# Altium schematic sheet rs232_24V_step_Vano.SchDoc: Название платы
size 594 x 420 mm; ApprovedBy: Рогов; CheckedBy: Фамилия проверяющего; DrawnBy: Фамилия разработчика; DocumentNumber: Введите номер платы + Э3; SheetNumber: пусто если листов 1, иначе 1; SheetTotal: количество листов; Format: A2; DocumentType: тип схемы; Title1str: (вторая строка при необходимости); ImagePath: Введите номер платы
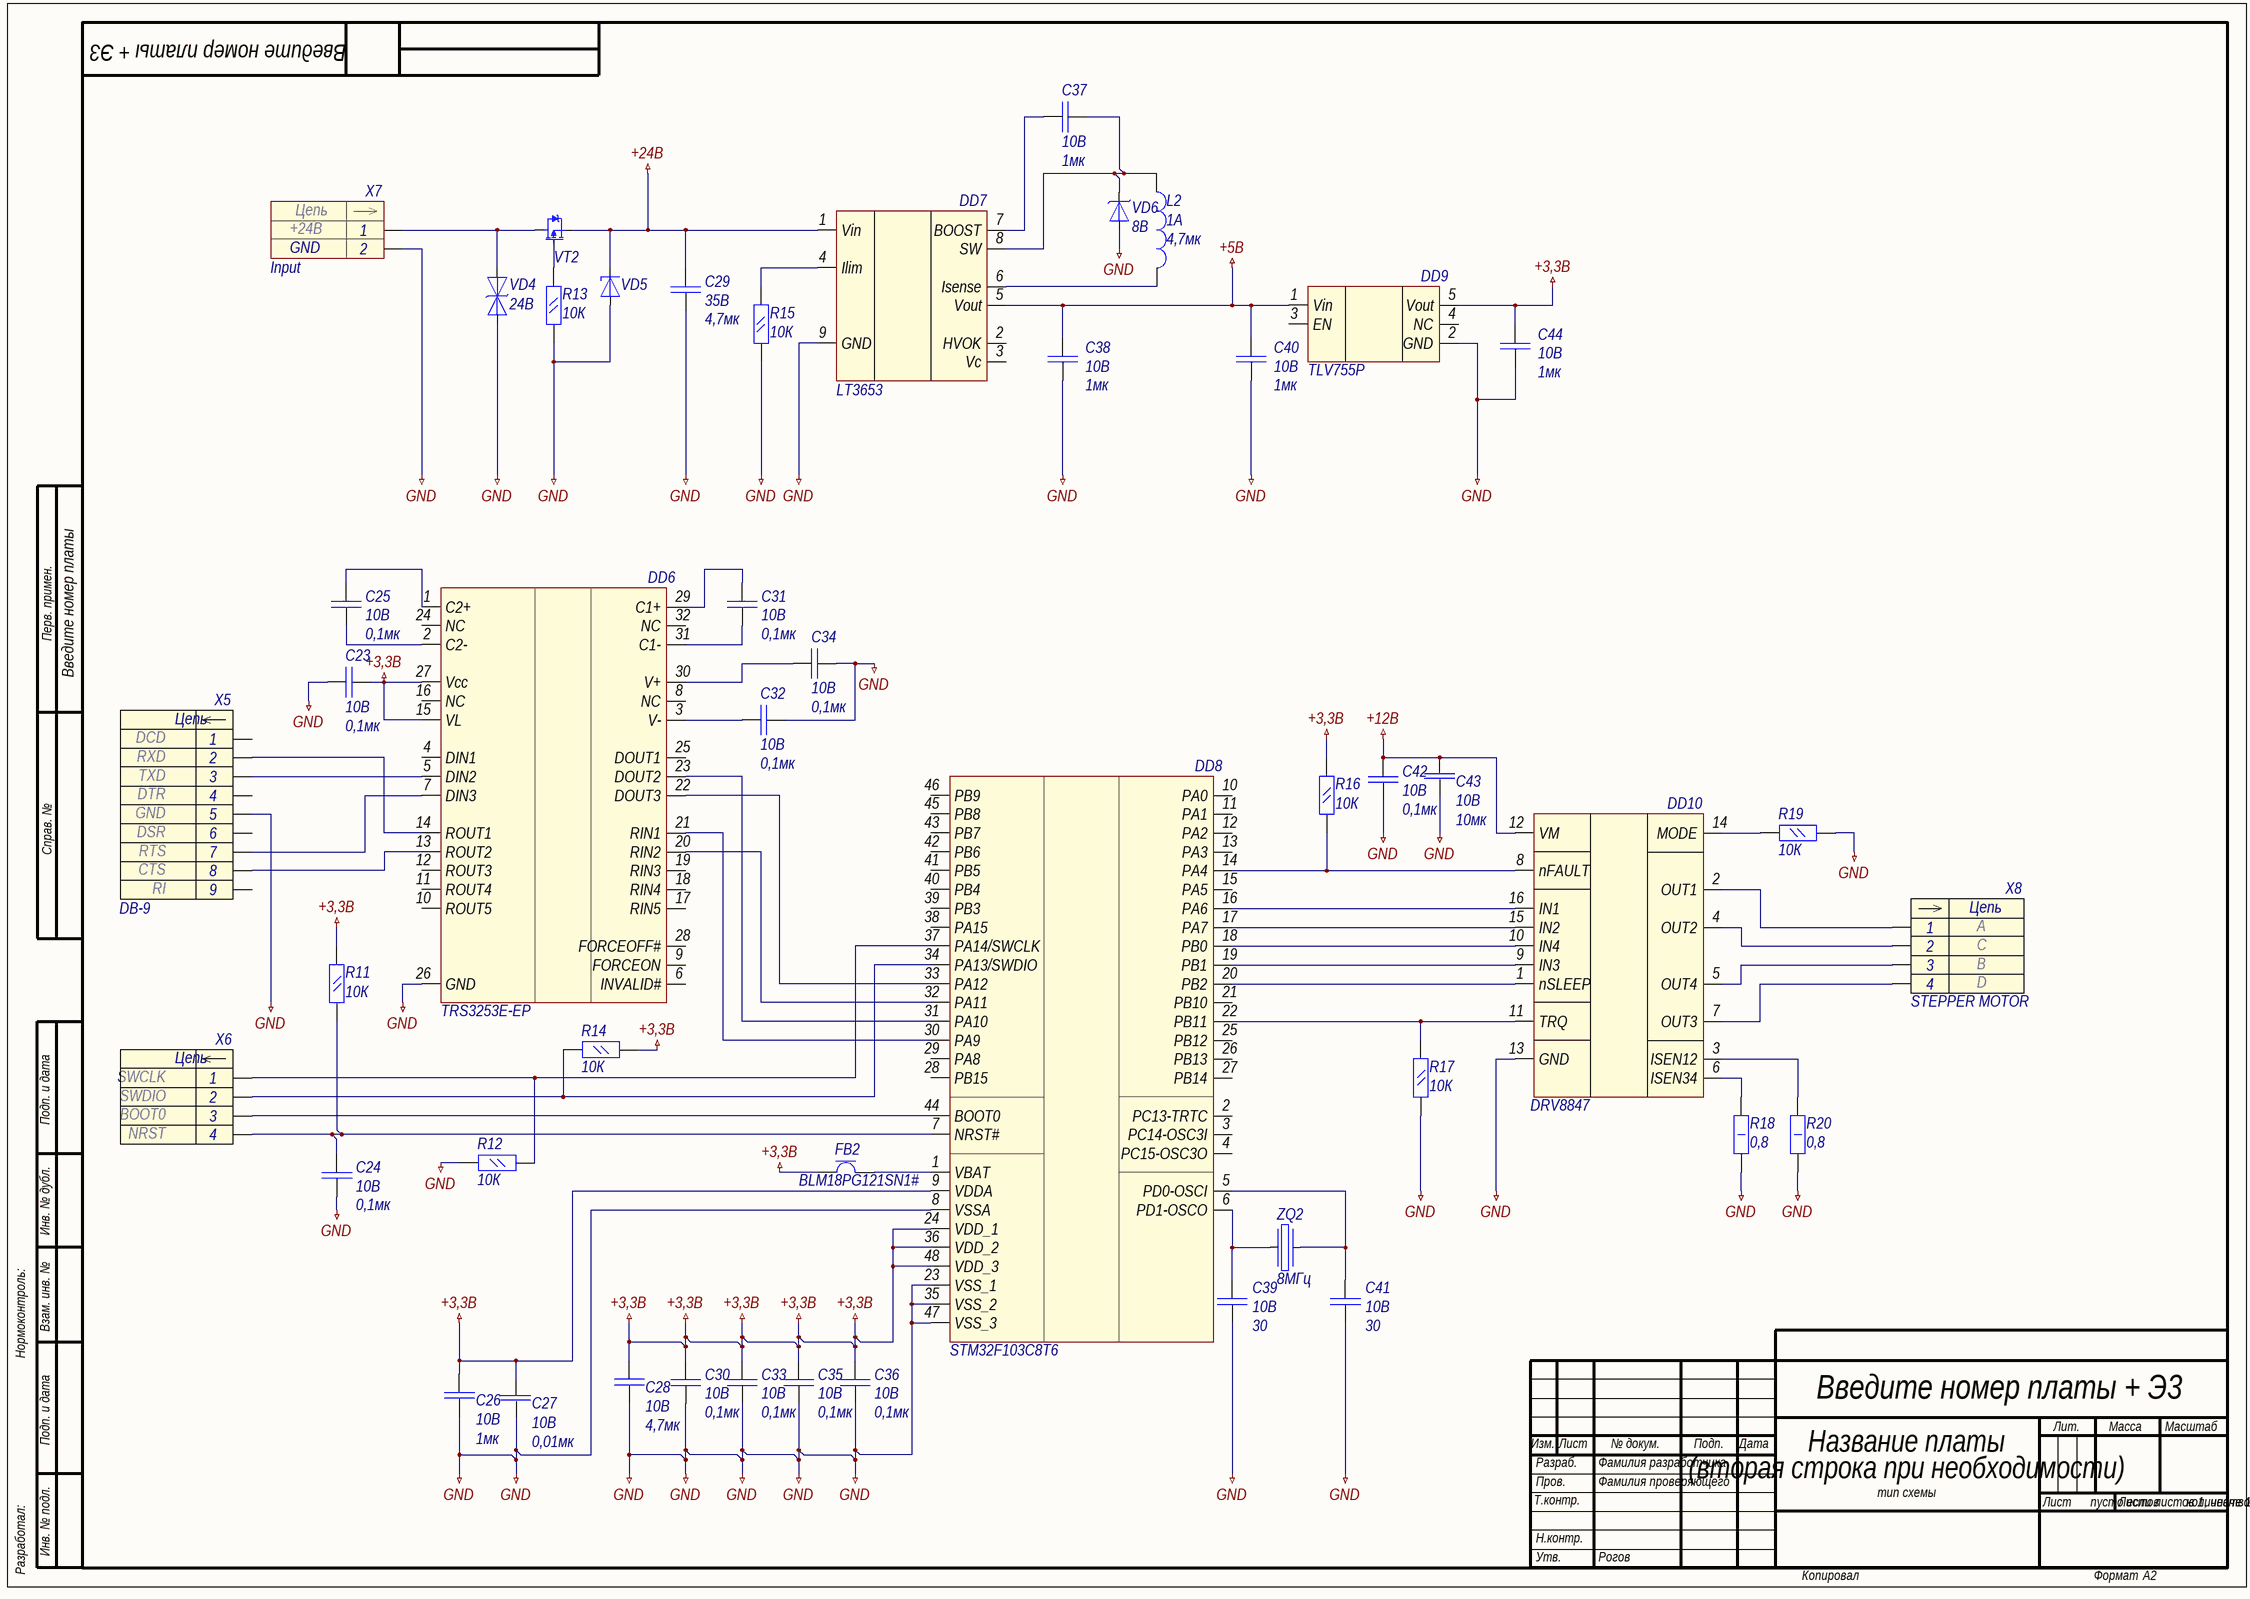
[diagram p0: rs232_24V_step_Vano.SchDoc]

## Parts
C23  Voltage: 10В  Capacitance: 0,1мк  [CH0402C]  (hidden comment: Capacitor)
C24  Voltage: 10В  Capacitance: 0,1мк  [CH0402C]  (hidden comment: Capacitor)
C25  Voltage: 10В  Capacitance: 0,1мк  [CH0402C]  (hidden comment: Capacitor)
C26  Voltage: 10В  Capacitance: 1мк  [CH0201C]  (hidden comment: Capacitor)
C27  Voltage: 10В  Capacitance: 0,01мк  [CH0402C]  (hidden comment: Capacitor)
C28  Voltage: 10В  Capacitance: 4,7мк  [CH0402C]  (hidden comment: Capacitor)
C29  Voltage: 35В  Capacitance: 4,7мк  [CH0603C]  (hidden comment: Capacitor)
C30  Voltage: 10В  Capacitance: 0,1мк  [CH0402C]  (hidden comment: Capacitor)
C31  Voltage: 10В  Capacitance: 0,1мк  [CH0402C]  (hidden comment: Capacitor)
C32  Voltage: 10В  Capacitance: 0,1мк  [CH0402C]  (hidden comment: Capacitor)
C33  Voltage: 10В  Capacitance: 0,1мк  [CH0402C]  (hidden comment: Capacitor)
C34  Voltage: 10В  Capacitance: 0,1мк  [CH0402C]  (hidden comment: Capacitor)
C35  Voltage: 10В  Capacitance: 0,1мк  [CH0402C]  (hidden comment: Capacitor)
C36  Voltage: 10В  Capacitance: 0,1мк  [CH0402C]  (hidden comment: Capacitor)
C37  Voltage: 10В  Capacitance: 1мк  [CH0201C]  (hidden comment: Capacitor)
C38  Voltage: 10В  Capacitance: 1мк  [CH0201C]  (hidden comment: Capacitor)
C39  Voltage: 10В  Capacitance: 30  [CH0201C]  (hidden comment: Capacitor)
C40  Voltage: 10В  Capacitance: 1мк  [CH0201C]  (hidden comment: Capacitor)
C41  Voltage: 10В  Capacitance: 30  [CH0201C]  (hidden comment: Capacitor)
C42  Voltage: 10В  Capacitance: 0,1мк  [CH0402C]  (hidden comment: Capacitor)
C43  Voltage: 10В  Capacitance: 10мк  [CH0402C]  (hidden comment: Capacitor)
C44  Voltage: 10В  Capacitance: 1мк  [CH0201C]  (hidden comment: Capacitor)
DD6  TRS3253E-EP  [TRS3253E-EP]
DD7  LT3653  [LT3653]
DD8  STM32F103C8T6  [STM32F103 48pins]
DD9  TLV755P  [SOT23-5]
DD10  DRV8847  [DRV8847]
FB2  Model: BLM18PG121SN1#  [CH0603L]  (hidden comment: Ferrite bead)
L2  Max current: 1А  Inductance: 4,7мк  [CH0805L]  (hidden comment: Inductor)
R11  Impedance: 10К  [CH0805R]  (hidden comment: Res_0.125)
R12  Impedance: 10К  [CH0805R]  (hidden comment: Res_0.125)
R13  Impedance: 10К  [CH0402R]  (hidden comment: Res_0.125)
R14  Impedance: 10К  [CH0805R]  (hidden comment: Res_0.125)
R15  Impedance: 10К  [CH0402R]  (hidden comment: Res_0.125)
R16  Impedance: 10К  [CH0402R]  (hidden comment: Res_0.125)
R17  Impedance: 10К  [CH0402R]  (hidden comment: Res_0.125)
R18  Impedance: 0,8  [CH2010R]  (hidden comment: Res_1)
R19  Impedance: 10К  [CH0402R]  (hidden comment: Res_0.125)
R20  Impedance: 0,8  [CH2010R]  (hidden comment: Res_1)
VD4  Thresh_Voltage: 24В  [SOD323]  (hidden comment: TVS-diod_simmetrical)
VD5  Diod Zener  [SOD123]  (value not drawn)
VD6  Clamping_Voltage: 8В  [SOD123W]  (hidden comment: TVS-diod_directed)
VT2  P-Channel  [SOT23_132]  (value not drawn)
X5  DB-9  1: DCD  2: RXD  3: TXD  4: DTR  5: GND  6: DSR  7: RTS  8: CTS  9: RI  [CON: DB-9F]
X6  2: SWDIO  3: BOOT0  1: SWCLK  4: NRST  [CON: CWF-4R]  (hidden comment: 4_pins)
X7  Input  Vcc: +24В  [CON: 163-179PH-EX]
X8  STEPPER MOTOR  2: C  3: B  1: A  4: D  [CON: CWF-4R]
ZQ2  Freq: 8МГц  [OSC: 5032]  (hidden comment: Oscillator)

## Nets
+3,3В: C23.2(C1-) C26.2(C1-) C27.1(С+) C28.2(C1-) C30.1(C1+) C33.1(C1+) C35.1(C1+) C36.1(C1+) C44.1(C1+) DD6.15(VL) DD6.27(Vcc) DD8.9(VDDA) DD8.24(VDD_1) DD8.36(VDD_2) DD8.48(VDD_3) DD9.5(Vout) FB2.1 R11.1(C1-) R14.2(C1-) R16.1(C1-)
+5В: C38.1(C1+) C40.1(C1+) DD7.5(Vout) DD9.1(Vin)
+12В: C42.1(C1+) C43.1(С+) DD10.12(VM)
+24В: C29.1(C1+) DD7.1(Vin) VD5.2(C) VT2.3(S)
GND: C23.1(C1+) C24.2(C1-) C26.1(C1+) C27.2(С-) C28.1(C1+) C29.2(C1-) C30.2(C1-) C32.2(C1-) C33.2(C1-) C34.2(C1-) C35.2(C1-) C36.2(C1-) C38.2(C1-) C39.2(C1-) C40.2(C1-) C41.2(C1-) C42.2(C1-) C43.2(С-) C44.2(C1-) DD6.26(GND) DD7.9(GND) DD8.8(VSSA) DD8.23(VSS_1) DD8.35(VSS_2) DD8.47(VSS_3) DD9.2(GND) DD10.13(GND) R12.1(C1-) R13.1 R15.1 R17.2(C1-) R18.1 R19.1(C1-) R20.1 VD4.1(A) VD5.1(A) VD6.1(A) X5.5 X7.2
NetC24_1: C24.1(C1+) DD8.7(NRST#) R11.2(C1-) X6.4
NetC25_1: C25.1(C1+) DD6.1(C2+)
NetC25_2: C25.2(C1-) DD6.2(C2-)
NetC31_1: C31.1(C1+) DD6.29(C1+)
NetC31_2: C31.2(C1-) DD6.31(C1-)
NetC32_1: C32.1(C1+) DD6.3(V-)
NetC34_1: C34.1(C1+) DD6.30(V+)
NetC37_1: C37.1(C1+) DD7.7(BOOST)
NetC37_2: C37.2(C1-) DD7.8(SW) L2.1 VD6.2(C)
NetC39_1: C39.1(C1+) DD8.6(PD1-OSCO) ZQ2.1
NetC41_1: C41.1(C1+) DD8.5(PD0-OSCI) ZQ2.3
NetDD6_5: DD6.5(DIN2) X5.3
NetDD6_7: DD6.7(DIN3) X5.7
NetDD6_13: DD6.13(ROUT2) X5.8
NetDD6_14: DD6.14(ROUT1) X5.2
NetDD6_20: DD6.20(RIN2) DD8.32(PA11)
NetDD6_21: DD6.21(RIN1) DD8.30(PA9)
NetDD6_22: DD6.22(DOUT3) DD8.33(PA12)
NetDD6_23: DD6.23(DOUT2) DD8.31(PA10)
NetDD7_4: DD7.4(Ilim) R15.2
NetDD7_6: DD7.6(Isense) L2.2
NetDD8_1: DD8.1(VBAT) FB2.2
NetDD8_14: DD8.14(PA4) DD10.8(nFAULT) R16.2(C1-)
NetDD8_16: DD8.16(PA6) DD10.16(IN1)
NetDD8_17: DD8.17(PA7) DD10.15(IN2)
NetDD8_18: DD8.18(PB0) DD10.10(IN4)
NetDD8_19: DD8.19(PB1) DD10.9(IN3)
NetDD8_20: DD8.20(PB2) DD10.1(nSLEEP)
NetDD8_22: DD8.22(PB11) DD10.11(TRQ) R17.1(C1-)
NetDD8_34: DD8.34(PA13/SWDIO) R14.1(C1-) X6.2
NetDD8_37: DD8.37(PA14/SWCLK) R12.2(C1-) X6.1
NetDD8_44: DD8.44(BOOT0) X6.3
NetDD10_2: DD10.2(OUT1) X8.1
NetDD10_3: DD10.3(ISEN12) R20.2
NetDD10_4: DD10.4(OUT2) X8.2
NetDD10_5: DD10.5(OUT4) X8.3
NetDD10_6: DD10.6(ISEN34) R18.2
NetDD10_7: DD10.7(OUT3) X8.4
NetDD10_14: DD10.14(MODE) R19.2(C1-)
NetR13_2: R13.2 VT2.1(G)
NetVD4_2: VD4.2(C) VT2.2(D) X7.1

Not connected (* = marked no-connect by the designer): DD6 4(DIN1) 6(INVALID#) 8(NC) 9(FORCEON) 10(ROUT5) 11(ROUT4) 12(ROUT3) 16(NC) 17(RIN5) 18(RIN4) 19(RIN3) 24(NC) 25(DOUT1) 28(FORCEOFF#) 32(NC); DD7 2(HVOK) 3(Vc); DD8 2(PC13-TRTC) 3(PC14-OSC3I) 4(PC15-OSC3O) 10(PA0) 11(PA1) 12(PA2) 13(PA3) 15(PA5) 21(PB10) 25(PB12) 26(PB13) 27(PB14) 28(PB15) 29(PA8) 38(PA15) 39(PB3) 40(PB4) 41(PB5) 42(PB6) 43(PB7) 45(PB8) 46(PB9); DD9 3(EN) 4(NC); X5 1 4 6 9

## Notes on the sheet
- Перв. примен.
- Справ. №
- Подп. и дата
- Инв. № дубл.
- Нормоконтроль:
- Взам. инв. №
- Изм.
- Лист
- № докум.
- Подп.
- Дата
- Лит.
- Масса
- Масштаб
- Т.контр.
- Пров.
- Разраб.
- Листов
- Разработал:
- Инв. № подл.
- Н.контр.
- Утв.
- Копировал
- Формат
- (in symbol 2_pins) Цепь; GND
- (in symbol 4_pins) Цепь
- (in symbol 9_pins) Цепь

## Library data of the parts
C23-C25 C30-C36 C42 = Capacitor: Manufacture: AVX; Model: 0402ZD103KAT2A; Case: 0402; HelpURL: https://ru.mouser.com/ProductDetail/AVX/0402ZD103KAT2A?qs=sGAEpiMZZMs0AnBnWHyRQKdiqyDPVQdAu74W%2fwwRq8A%3d
C26 C37 C38 C40 C44 = Capacitor: Manufacture: Murata Electronics; Model: GRM033C81A105ME05E; Case: 0201; HelpURL: https://ru.mouser.com/ProductDetail/Murata-Electronics/GRM033C81A105ME05E?qs=sGAEpiMZZMs0AnBnWHyRQN7%2fAA2D2lPPXfhIkJ3ChWM%252bNp28BKy3Ug%3d%3d
C27 = Capacitor: Manufacture: Yageo; Model: CC0402MRX7R6BB103; Case: 0402; HelpURL: https://ru.mouser.com/ProductDetail/Yageo/CC0402MRX7R6BB103?qs=sGAEpiMZZMs0AnBnWHyRQCF1lTWZ1EBLC11KxQK9NtY%3D
C28 = Capacitor: Manufacture: Murata Electronics; Model: ZRB15XR61A475KE01D; Case: 0402; HelpURL: https://ru.mouser.com/ProductDetail/Murata-Electronics/ZRB15XR61A475KE01D?qs=sGAEpiMZZMs0AnBnWHyRQO9VYadaKTO%252beZnE9zFUsbv4FmCibz4ZfQ%3d%3d
C29 = Capacitor: Manufacture: TDK; Model: C1608JB1V475M080AC; Case: 0603; HelpURL: https://ru.mouser.com/ProductDetail/TDK/C1608JB1V475M080AC?qs=sGAEpiMZZMs0AnBnWHyRQFv7x1xn%252bYFd6VAPnwlpyGEmZrVGUJGxTQ%3d%3d
C39 C41 = Capacitor: Manufacture: KEMET; Model: CBR02C308B8GAC; Case: 0201; HelpURL: https://ru.mouser.com/ProductDetail/KEMET/CBR02C308B8GAC?qs=sGAEpiMZZMs0AnBnWHyRQKJCfzG%2fi9wHnix1yOwfSPhOUzhoHh%252bTpQ%3d%3d
C43 = Capacitor: Manufacture: Yageo; Model: CC0402MRX5R6BB106; Case: 0402; HelpURL: https://ru.mouser.com/ProductDetail/Yageo/CC0402MRX5R6BB106?qs=sGAEpiMZZMsh%252B1woXyUXj67dvM3QAimZTx2LImfM178%3D
DD6 = TRS3253E-EP: UART - RS232; Manufacture: Texas Instruments; Model: TRS3253E-EP; Case: PQFN-32; HelpURL: http://www.ti.com/product/trs3253e-ep
DD7 = LT3653: 7.5~30 to 5; Case: *; Manufacture: *; Model: LT3653; HelpURL: *
DD8 = STM32: Manufacture: STMicroelectronics; Case: LQFP48; Model: STM32F103C8T6; HelpURL: https://www.st.com/en/microcontrollers-microprocessors/stm32f103c8.html
DD9 = LDO +3.3V: Manufacture: Texas Instruments; Case: SOT-23; HelpUrL: http://www.ti.com/product/TLV755P?keyMatch=TLV755P&tisearch=Search-EN-Everything; Model: TLV755P
DD10 = DRV8847: Manufacture: Texas Instruments; HelpURL: http://www.ti.com/product/DRV8847; Case: TSSOP; Model: DRV8847
FB2 = Ferrite bead: Manufacture: murata; Max current: 2A; Impedance: 120; Case: 0603; HelpURL: https://www.murata.com/en-us/products/productdetail?partno=BLM18PG121SN1%23; Inductance: *
L2 = Inductor: Manufacture: Panasonic; Model: ELG-TEA4R7NA; Impedance: 300м; HelpURL: https://ru.mouser.com/ProductDetail/Panasonic/ELG-TEA4R7NA?qs=sGAEpiMZZMsg%252by3WlYCkU%252bdHxGw%252bjF29VUqcX1cNOgM%3d; Case: 0805
R11 R12 R14 = Res_0.125: Manufacture: Panasonic Industrial Devices; Model: ERJ-6ENF9091V; Case: 0805; HelpURL: https://ru.mouser.com/ProductDetail/Panasonic-Industrial-Devices/ERJ-6ENF9091V?qs=sGAEpiMZZMvdGkrng054tx7%2f6%252bNA3LAJZkxjwUnWjWM%3d
R13 R15-R17 R19 = Res_0.125: Manufacture: Yageo; Model: AC0402FR-7W10KL; Case: 0402; HelpURL: https://ru.mouser.com/ProductDetail/Yageo/AC0402FR-7W10KL?qs=sGAEpiMZZMvdGkrng054txbN%2f5LBcxld3gyqgmBuiXRPLjwmdNqO3A%3d%3d
R18 R20 = Res_1: Manufacture: Vishay Dale; Model: CRCW20101K69FKEF; Power: 1Вт; Case: 2010; HelpURL: https://www.digikey.com/product-detail/en/CRCW20101K69FKEF/541-1.69KACCT-ND/1179159?WT.z_cid=ref_netcomponents_dkc_buynow&utm_source=netcomponents&utm_medium=aggregator&utm_campaign=buynow
VD4 = TVS-diod_simmetrical: Manufacturer: Torex Semiconductor; Model: XBP1012-G; Case: SOD-323P; HelpURL: https://ru.mouser.com/Semiconductors/Discrete-Semiconductors/Diodes-Rectifiers/TVS-Diodes-ESD-Suppressors/_/N-azknd?P=1z0z7ymZ1yzv44xZ1y95zfoZ1z0x69g&Ns=Package+%2f+Case%7c0
VD6 = TVS-diod_directed: Manufacturer: Nexperia; Model: PTVS3V3S1UTR,115; HelpURL: https://ru.mouser.com/ProductDetail/Nexperia/PTVS3V3S1UTR115?qs=sGAEpiMZZMsItbzKdwyIe55sLWjhUV0FnMtsDZGUovc%3d; Ipp: *; Case: SOD-123W
VT2 = P-Channel: Manufacture: Diodes Incorporated; Id: 3,4А; Model: DMP4065S-7; Vgs: 1В; Vsd: 40В; HelpURL: https://ru.mouser.com/ProductDetail/Diodes-Incorporated/DMP4065S-7?qs=sGAEpiMZZMshyDBzk1%2fWizUdW5KNcF83uXTduzoNpXIy82%252bBOlvohQ%3d%3d
X5 = 9_pins: Case: DB-9; HelpURL: https://www.digikey.com/product-detail/en/assmann-wsw-components/A-DS-09-LL-Z/AE10972-ND/1241781; Manufacture: *; Model: DB-9
X6 = 4_pins: Manufacture: Omron Electronics; Model: XN2D-4471; HelpURL: https://ru.mouser.com/ProductDetail/Omron-Electronics/XN2D-4471?qs=sGAEpiMZZMvd2mIcYG7oaC0TeQEBnk0JvHtcE4UuDS0%3D; Case: *
X7 = 2_pins: HelpURL: https://ru.farnell.com/gct-global-connector-technology/dcj250-10-a-k1-k/dc-power-jack-5a-20vdc-black/dp/2524130?st=power%20jack
X8 = 4_pins: Bipolar Stepper Motor 200 Step 0.35A 12VDC; Manufacture: stepperonline; ManufactureConnector: Omron Electronics; Model: 8HS11-0204S; ModelConnector: XN2D-4471; HelpURL: https://www.omc-stepperonline.com/nema-8-stepper-motor/nema-8-bipolar-18deg-16ncm-23ozin-02a-48v-20x20x28mm-4-wires-8hs11-0204s.html; Case: 20x20x28mm; CaseConnector: *; HelpURLConnector: https://ru.mouser.com/ProductDetail/Omron-Electronics/XN2D-4471?qs=sGAEpiMZZMvd2mIcYG7oaC0TeQEBnk0JvHtcE4UuDS0%3D
ZQ2 = Oscillator: Manufacture: CTS Electronic Components; Model: 636L3C008M00000; HelpURL: https://ru.mouser.com/ProductDetail/CTS-Electronic-Components/636L3C008M00000?qs=sGAEpiMZZMt8zWNA7msRCjl4WCD9T6KEFNudNQm%252BeAU%3D; Case: 5x3,2mm
VD5 = Diod Zener: ComponentKind: *; Manufacturer: *; Model: *; HelpURL: *; Thresh_Voltage: *